# Altium project ballast.PrjPCB
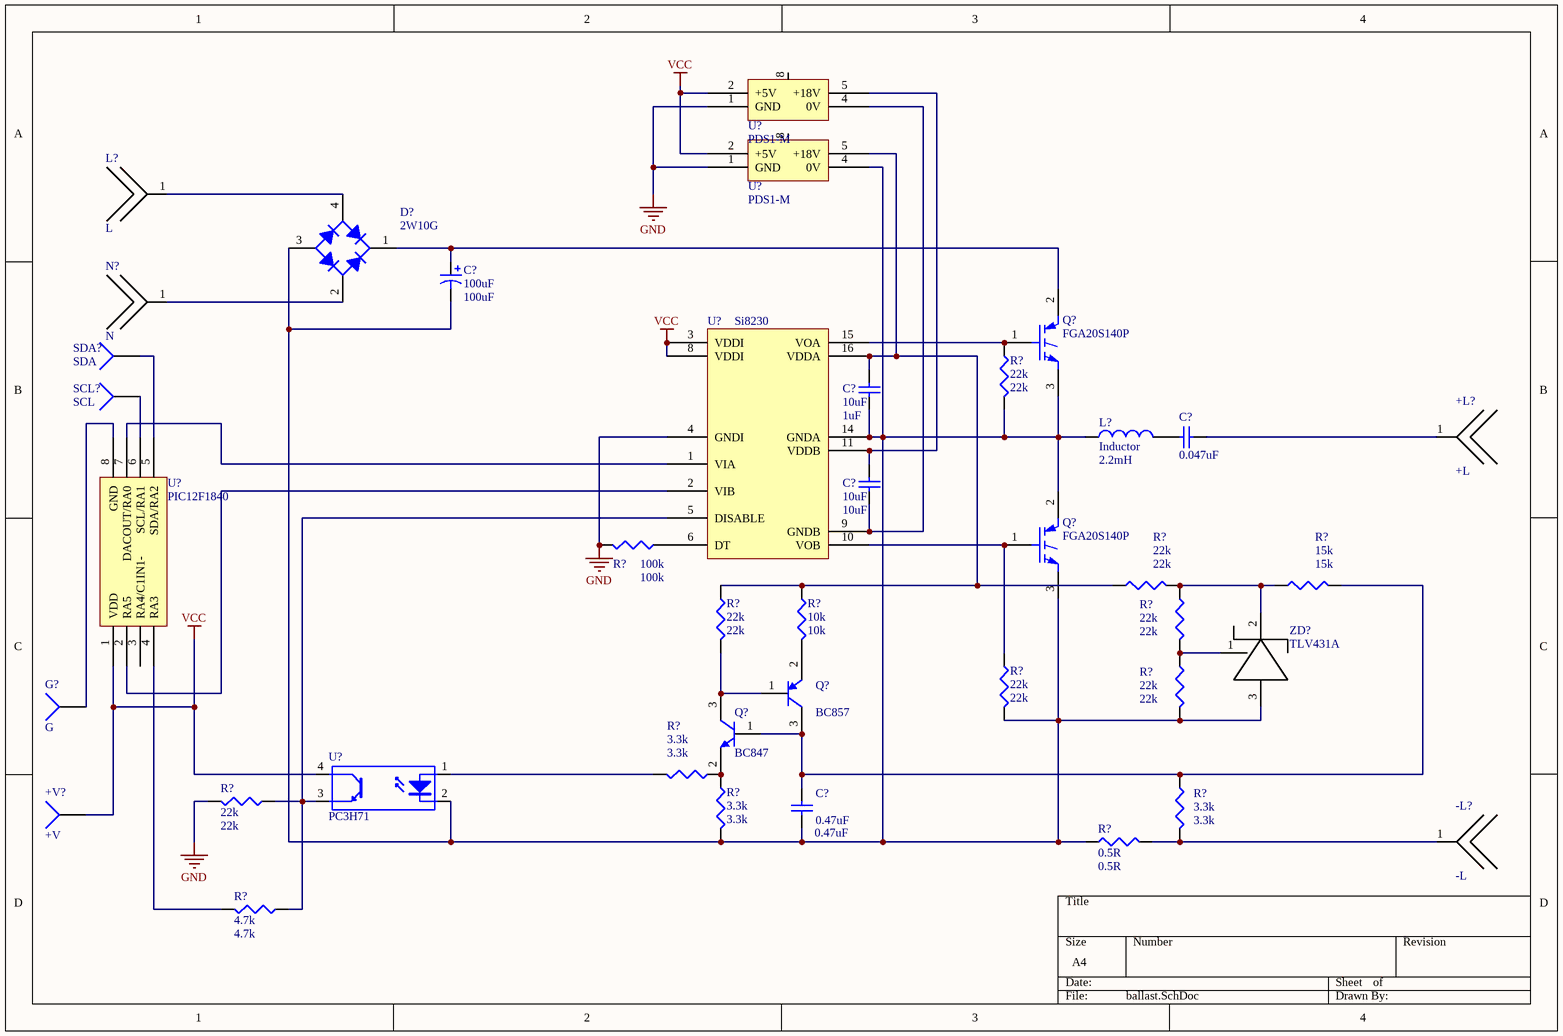
[diagram p0: ballast.SchDoc]
1 sheet, 40 parts. Net scope: global (net labels, ports and power ports of the same name join across sheets).

## Sheet ballast.SchDoc
size A4

### Parts
(Parts that share a designator on the sheet are numbered #1, #2 ... from top to bottom, then left to right.)
+L?  +L
+V?  +V  [PIN1]
-L?  -L
C?#1  100uF  [RB7.6-15]
C?#2  10uF  value 1uF  [C1206]
C?#3  0.047uF  [1608[0603]]
C?#4  10uF  [C1206]
C?#5  0.47uF  [1608[0603]]
D?  2W10G  [D-38]
G?  G  [PIN1]
L?#1  L
L?#2  Inductor  value 2.2mH  [0402-A]
N?  N
Q?#1  FGA20S140P  [TO-247]
Q?#2  FGA20S140P  [TO-247]
Q?#3  BC857  [SOT-23_N]
Q?#4  BC847  [SOT-23_N]
R?#1  22k  [J1-0603]
R?#2  100k  [J1-0603]
R?#3  22k  [J1-0603]
R?#4  15k  [J1-0603]
R?#5  22k  [J1-0603]
R?#6  10k  [J1-0603]
R?#7  22k  [J1-0603]
R?#8  22k  [J1-0603]
R?#9  22k  [J1-0603]
R?#10  3.3k  [J1-0603]
R?#11  3.3k  [J1-0603]
R?#12  3.3k  [J1-0603]
R?#13  22k  [J1-0603]
R?#14  0.5R  [J1-0603]
R?#15  4.7k  [J1-0603]
SCL?  SCL  [PIN1]
SDA?  SDA  [PIN1]
U?#1  PDS1-M  [PDS1-M]
U?#2  PDS1-M  [PDS1-M]
U?#3  Si8230
U?#4  PIC12F1840  [SOIC150-8_N]
U?#5  PC3H71  [DIP-4]
ZD?  TLV431A  [SOT-23_N]

### Nets
GND: R?#2.2 R?#13.2 U?#1.1(GND) U?#2.1(GND) U?#3.4(GNDI)
VCC: +V?.1 U?#1.2(+5V) U?#2.2(+5V) U?#3.3(VDDI) U?#3.8(VDDI) U?#4.1(VDD) U?#5.4(C)
Net+L?_1: +L?.1 C?#3.1
Net-L?_1: -L?.1 R?#12.2 R?#14.2
NetC?#1_1: C?#1.1 D?.1(K) Q?#1.2(C)
NetC?#1_2: C?#1.2 C?#2.1 C?#5.1 D?.3(A) L?#2.1 Q?#1.3(E) Q?#2.2(C) Q?#2.3(E) R?#1.2 R?#8.2 R?#9.2 R?#11.2 R?#14.1 U?#2.4(0V) U?#3.14(GNDA) U?#5.2(K) ZD?.3
NetC?#2_2: C?#2.2 R?#3.1 R?#5.1 R?#6.1 U?#2.5(+18V) U?#3.16(VDDA)
NetC?#3_2: C?#3.2 L?#2.2
NetC?#4_1: C?#4.1 U?#1.4(0V) U?#3.9(GNDB)
NetC?#4_2: C?#4.2 U?#1.5(+18V) U?#3.11(VDDB)
NetC?#5_2: C?#5.2 Q?#3.3(C) Q?#4.1(B) R?#4.2 R?#12.1
NetD?_2: D?.2(C) N?.1
NetD?_4: D?.4(C) L?#1.1
NetG?_1: G?.1 U?#4.8(GND)
NetQ?#1_1: Q?#1.1(G) R?#1.1 U?#3.15(VOA)
NetQ?#2_1: Q?#2.1(G) R?#8.1 U?#3.10(VOB)
NetQ?#3_1: Q?#3.1(B) Q?#4.3(C) R?#5.2
NetQ?#3_2: Q?#3.2(E) R?#6.2
NetQ?#4_2: Q?#4.2(E) R?#10.1 R?#11.1
NetR?#2_1: R?#2.1 U?#3.6(DT)
NetR?#3_2: R?#3.2 R?#4.1 R?#7.1 ZD?.2
NetR?#7_2: R?#7.2 R?#9.1 ZD?.1
NetR?#10_2: R?#10.2 U?#5.1(A)
NetR?#13_1: R?#13.1 R?#15.1 U?#3.5(DISABLE) U?#5.3(E)
NetR?#15_2: R?#15.2 U?#4.4(RA3)
NetSCL?_1: SCL?.1 U?#4.6(SCL/RA1)
NetSDA?_1: SDA?.1 U?#4.5(SDA/RA2)
NetU?#3_1: U?#3.1(VIA) U?#4.7(DACOUT/RA0)
NetU?#3_2: U?#3.2(VIB) U?#4.2(RA5)

Not connected (* = marked no-connect by the designer): U?#1 8; U?#2 8; U?#4 3(RA4/C1IN1-)

### Library data of the parts
+L? -L? L?#1 N? = PWRCON2X
+V? G? SCL? SDA? = Socket: LatestRevisionDate: 17-Jul-2002; LatestRevisionNote: Re-released for DXP Platform.; Publisher: Altium Limited
C?#1 = Cap Pol1: Polarized Capacitor (Radial); Published: 8-Jun-2000; LatestRevisionDate: 17-Jul-2002; LatestRevisionNote: Re-released for DXP Platform.; PackageReference: RB7.6-15; Publisher: Altium Limited; PackageDescription: Polarized Capacitor (Radial); 2 Leads; Value: 100uF
C?#2 C?#4 C?#5 = Cap Semi: Capacitor (Semiconductor SIM Model); Published: 8-Jun-2000; LatestRevisionDate: 29-May-2009; LatestRevisionNote: IPC-7351 Footprint Added.; PackageReference: C1206; Publisher: Altium Limited; PackageDescription: Chip Capacitor
  C?#4: Value: 10uF
  C?#5: Value: 0.47uF
C?#3 = Cap Semi: Capacitor (Semiconductor SIM Model); Value: 0.47uF; Published: 8-Jun-2000; LatestRevisionDate: 29-May-2009; LatestRevisionNote: IPC-7351 Footprint Added.; PackageReference: C1206; Publisher: Altium Limited; PackageDescription: Chip Capacitor
D? = Bridge1: Full Wave Diode Bridge; Published: 8-Jun-2000; LatestRevisionDate: 29-May-2009; LatestRevisionNote: Sch pins A & K swapped.; DatasheetVersion: E2732B; PackageReference: D-38; Publisher: Altium Limited; PackageDescription: Bridge Rectifier; 4 Terminals; Body 9.4 x 9.4 mm (typ); Pitch 5.08 mm
L?#2 = Inductor: Code_IEC: 1005; Published: 8-Jun-2000; LatestRevisionDate: 29-May-2009; LatestRevisionNote: IPC-7351 Footprint Added.; PackageReference: 0402-A; Publisher: Altium Limited; PackageDescription: Chip Inductor; Code_JEITA: 0402
Q?#1 Q?#2 = IGBT-N: Insulated Gate Bipolar Transistor (N-Channel); Published: 8-Jun-2000; LatestRevisionDate: 17-Jul-2002; LatestRevisionNote: Re-released for DXP Platform.; DatasheetVersion: PD-9.684A; PackageReference: TO-247; Publisher: Altium Limited; PackageDescription: SIP with Mounting Hole; 3 Leads; Body 20 x 15.6 x 5 mm (typ); Pitch 5.45 mm; Code_JEDEC: TO-247-AC; ComponentLink1Description: Manufacturer Link; ComponentLink1URL: http://www.irf.com/
Q?#3 = PNP: PNP Bipolar Transistor; Published: 8-Jun-2000; LatestRevisionDate: 29-May-2009; LatestRevisionNote: IPC-7351 Footprint Added.; PackageVersion: Aug-1999; PackageReference: SOT-23B; Publisher: Altium Limited; PackageDescription: 3-Pin SOT-23 Package 0.95 mm Pitch, 2.4 mm Lead Span
Q?#4 = NPN: NPN Bipolar Transistor; Published: 8-Jun-2000; LatestRevisionDate: 17-Jul-2002; LatestRevisionNote: Re-released for DXP Platform.; PackageReference: TO-226-AA; Publisher: Altium Limited; PackageDescription: TO, Flat Index; 3 In-Line, Axial Leads; Body Dia. 4.8mm; Leads 0.55 x 0.51 mm (max); Code_JEDEC: TO-226-AA
R?#1-R?#15 = Res3: Resistor; Published: 8-Jun-2000; LatestRevisionDate: 29-May-2009; LatestRevisionNote: IPC-7351 Footprint Added.; PackageReference: J1-0603; Publisher: Altium Limited; PackageDescription: Chip Resistor
  R?#1 R?#3 R?#5 R?#7-R?#9 R?#13: Value: 22k
  R?#2: Value: 100k
  R?#4: Value: 15k
  R?#6: Value: 10k
  R?#10-R?#12: Value: 3.3k
  R?#14: Value: 0.5R
  R?#15: Value: 4.7k
U?#3 = Si8232
U?#5 = Optoisolator1: 4-Pin Phototransistor Optocoupler; Published: 24-Mar-1999; LatestRevisionDate: 04-Mar-2005; LatestRevisionNote: Sch pins 3 & 4 Swapped.; DatasheetVersion: Nov-2003; PackageReference: DIP-4; Publisher: Altium Limited